# EasyEDA Pro project NI接口485_测试板子_3.eprj, board PCB1
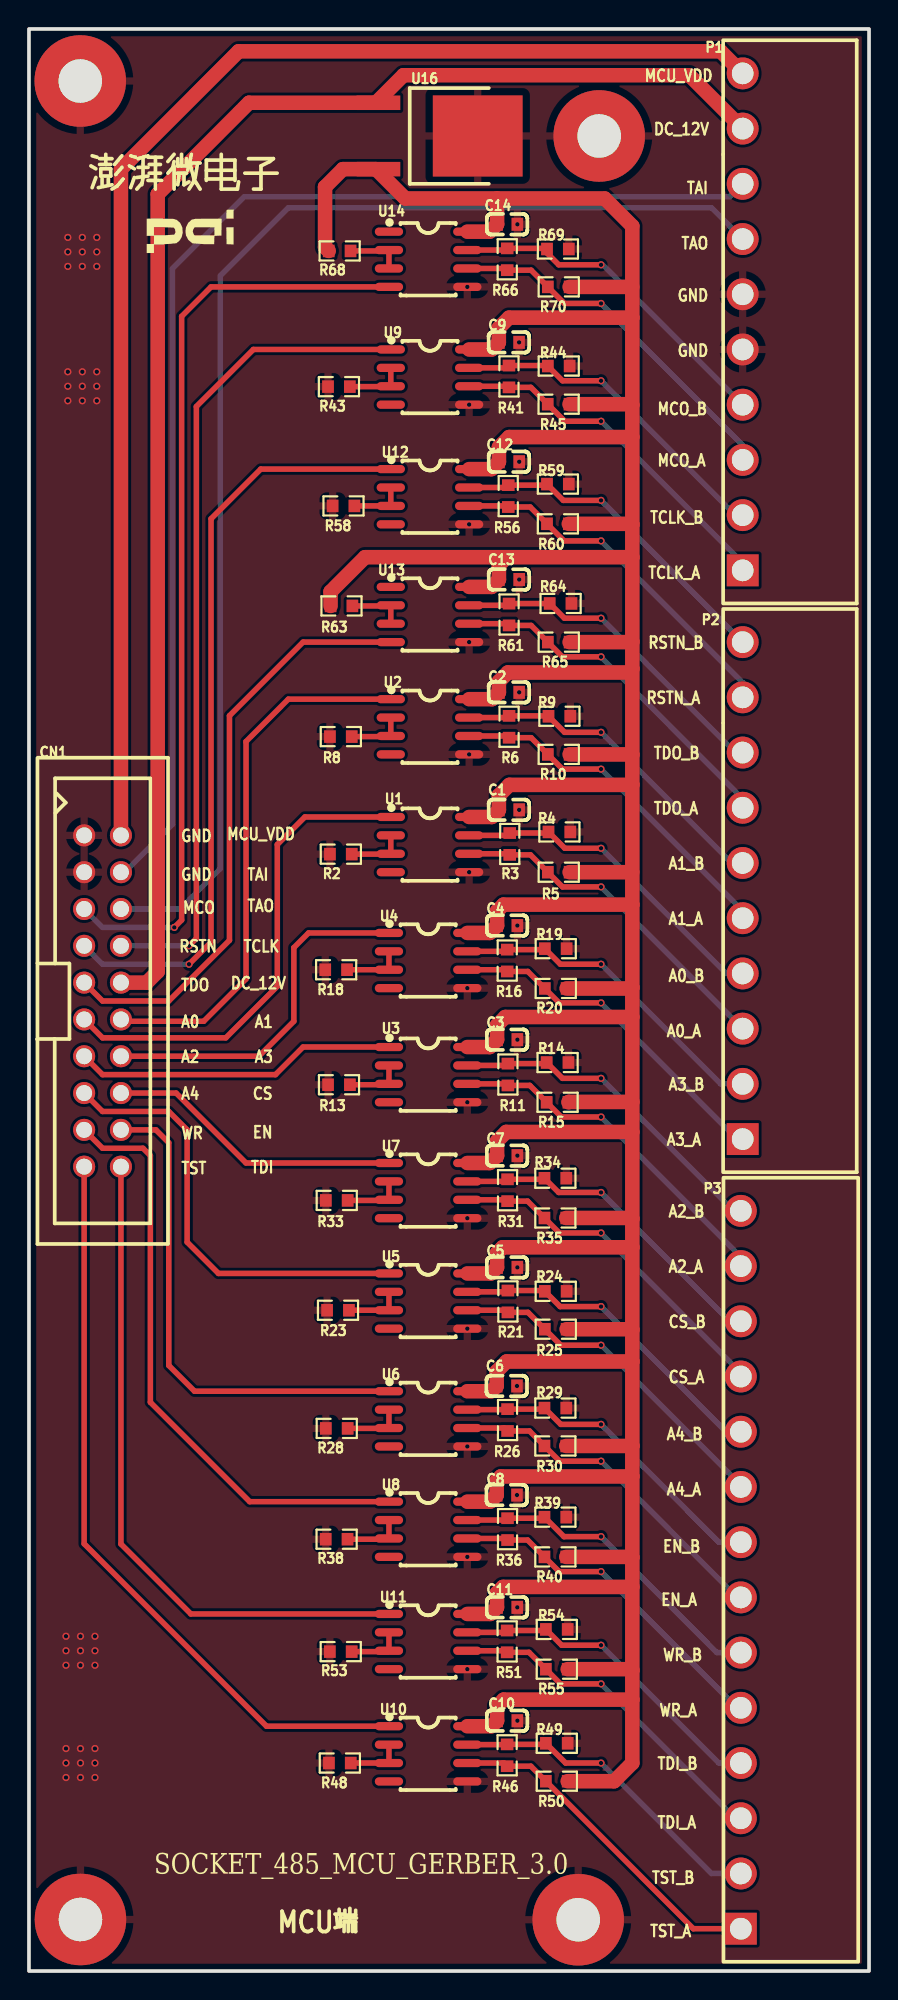
[diagram p2: board, top side]
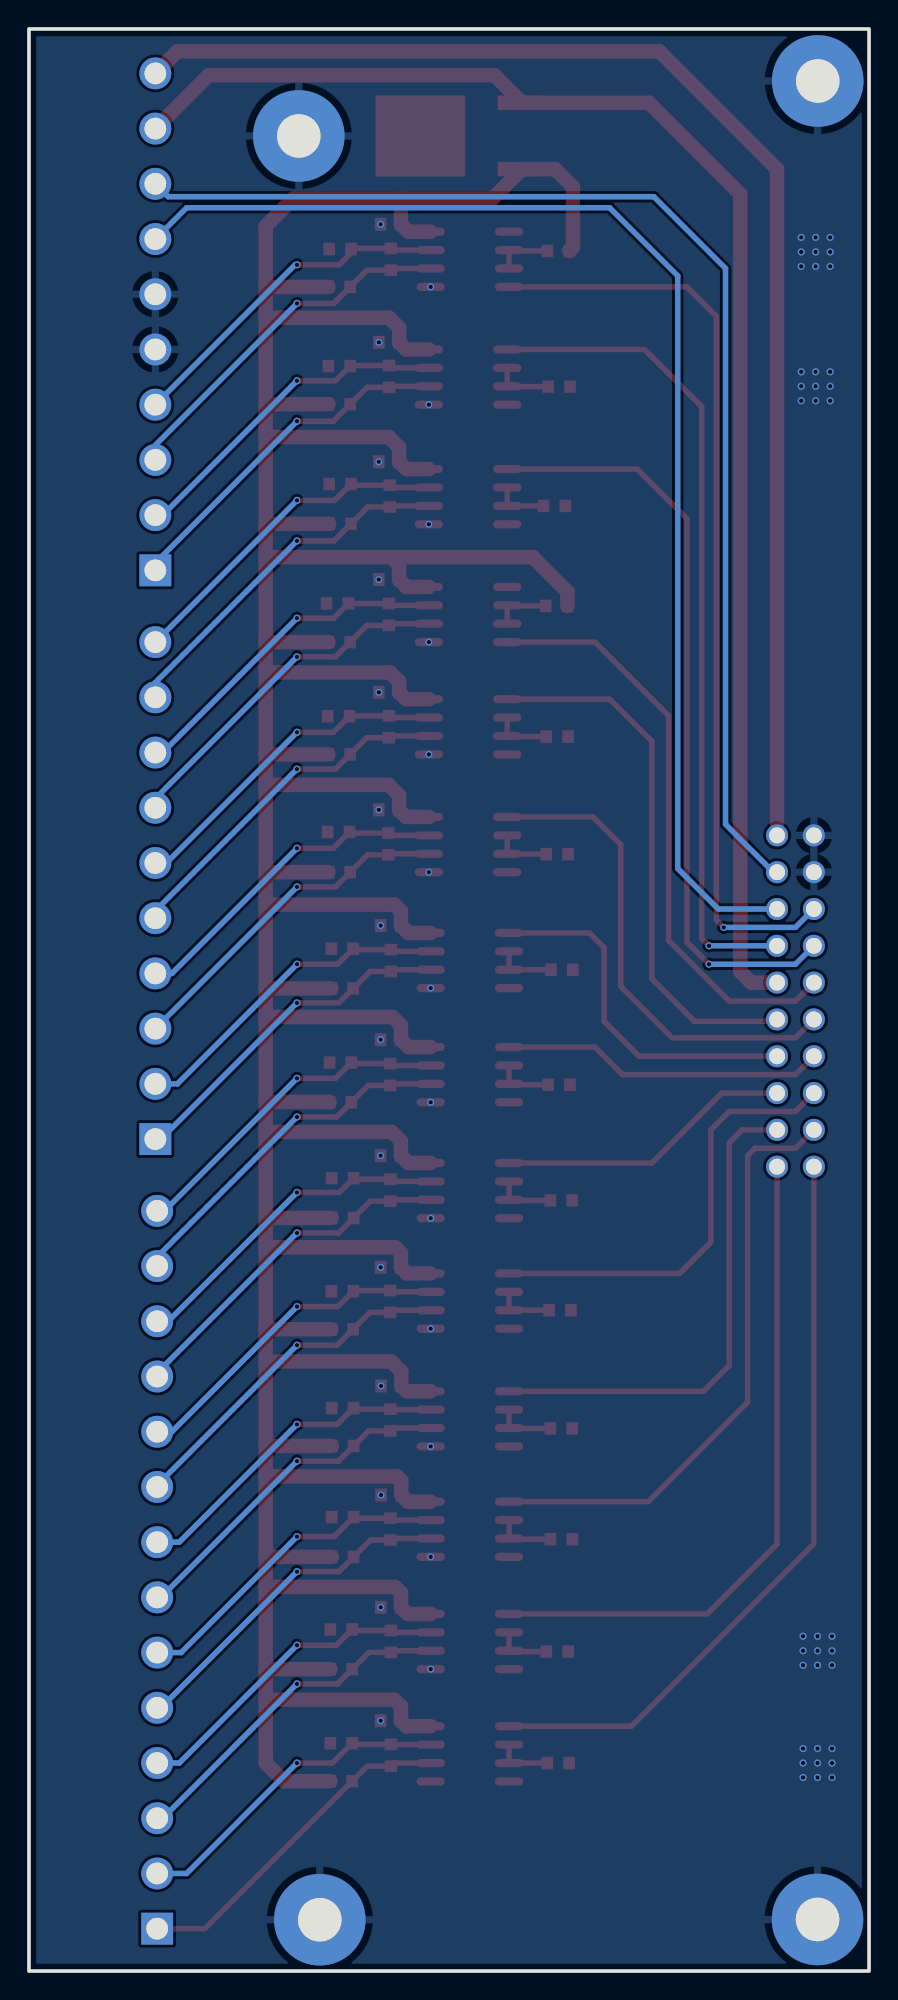
[diagram p3: board, bottom side, seen from below]

Outline 58 x 134 mm; copper layers: Top Layer, Bottom Layer. Coordinates in mm from the lower left corner of the outline.
Outline path: rectangle 0,134 58,0
Stack: Top Layer 0.035mm / Dielectric1 1.51mm FR4 er 4.5 / Bottom Layer 0.035mm

## Design rules (mm)
template: 自定义配置
spacing copperThickness1oz (default): track to track 0.102, other pairs 0.152 to 0.3
spacing copperThickness2oz: track to track 0.203, other pairs 0.152 to 0.3
track width copperThickness1oz (default): min 0.127, default 0.254, max 2.54
track width copperThickness2oz: min 0.203, default 0.254, max 2.54
differential pair differentialPair (default): width min 0.127, default 0.254, max 2.54; gap min 0.152, default 0.152
via viaSize (default): diameter min 0.5, default 0.61, max 10; hole min 0.3, default 0.305, max 6.3

## Placement (name value [footprint] x y rotation side)
C1  10uF  [C0603]  33.15 80.12 0 top
C2  10uF  [C0603]  33.15 88.23 0 top
C3  10uF  [C0603]  33.02 64.26 0 top
C4  10uF  [C0603]  33.02 72.14 0 top
C5  10uF  [C0603]  33.02 48.55 0 top
C6  10uF  [C0603]  32.99 40.37 0 top
C7  10uF  [C0603]  33.02 56.26 0 top
C8  10uF  [C0603]  32.99 32.84 0 top
C9  10uF  [C0603]  33.14 112.38 0 top
C10  10uF  [C0603]  33.02 17.27 0 top
C11  10uF  [C0603]  33.01 25.09 0 top
C12  10uF  [C0603]  33.15 104.14 0 top
C13  10uF  [C0603]  33.15 96.01 0 top
C14  10uF  [C0603]  33.02 120.52 0 top
CN1  BH254V-20P  [CONN-TH_20P-P2.54_0702462001]  5.08 66.93 270 top
J1  -  [demo板安装孔]  3.56 3.56 0 top
J2  -  [demo板安装孔]  39.37 126.62 0 top
J3  -  [demo板安装孔]  3.54 130.41 0 top
J4  -  [demo板安装孔]  37.92 3.54 0 top
P1  WJ15EDGRC-3.81-10P  [CONN-TH_10P-P3.81_WJ15EDGRC-3.81-10P]  49.28 113.79 90 top
P2  WJ15EDGRC-3.81-10P  [CONN-TH_10P-P3.81_WJ15EDGRC-3.81-10P]  49.28 74.55 90 top
P3  WJ15EDGRC-3.81-14P  [CONN-TH_14P-P3.81_WJ15EDGRC-3.81-14P]  49.15 27.69 90 top
R2  4.7kΩ  [R0603]  21.53 77.06 180 top
R3  120Ω  [R0603]  33.19 77.77 90 top
R4  4.7kΩ  [R0603]  36.62 78.59 0 top
R5  4.7kΩ  [R0603]  36.58 75.82 180 top
R6  120Ω  [R0603]  33.15 85.85 90 top
R8  4.7kΩ  [R0603]  21.53 85.17 180 top
R9  4.7kΩ  [R0603]  36.62 86.58 0 top
R10  4.7kΩ  [R0603]  36.58 83.95 180 top
R11  120Ω  [R0603]  33.07 61.86 90 top
R13  4.7kΩ  [R0603]  21.4 61.15 180 top
R14  4.7kΩ  [R0603]  36.5 62.69 0 top
R15  4.7kΩ  [R0603]  36.5 59.94 180 top
R16  120Ω  [R0603]  33.02 69.72 90 top
R18  4.7kΩ  [R0603]  21.21 69.09 180 top
R19  4.7kΩ  [R0603]  36.37 70.54 0 top
R20  4.7kΩ  [R0603]  36.37 67.8 180 top
R21  120Ω  [R0603]  33.07 46.2 90 top
R23  4.7kΩ  [R0603]  21.34 45.59 180 top
R24  4.7kΩ  [R0603]  36.37 46.9 0 top
R25  4.7kΩ  [R0603]  36.37 44.28 180 top
R26  120Ω  [R0603]  33.04 38.02 90 top
R28  4.7kΩ  [R0603]  21.25 37.44 180 top
R29  4.7kΩ  [R0603]  36.34 38.84 0 top
R30  4.7kΩ  [R0603]  36.34 36.23 180 top
R31  120Ω  [R0603]  33.04 53.87 90 top
R33  4.7kΩ  [R0603]  21.25 53.17 180 top
R34  4.7kΩ  [R0603]  36.34 54.7 0 top
R35  4.7kΩ  [R0603]  36.34 51.96 180 top
R36  120Ω  [R0603]  33.04 30.49 90 top
R38  4.7kΩ  [R0603]  21.24 29.79 180 top
R39  4.7kΩ  [R0603]  36.34 31.32 0 top
R40  4.7kΩ  [R0603]  36.34 28.57 180 top
R41  120Ω  [R0603]  33.14 110.03 90 top
R43  4.7kΩ  [R0603]  21.4 109.32 180 top
R44  4.7kΩ  [R0603]  36.58 110.74 0 top
R45  4.7kΩ  [R0603]  36.57 108.11 180 top
R46  120Ω  [R0603]  33.01 14.88 90 top
R48  4.7kΩ  [R0603]  21.46 14.35 180 top
R49  4.7kΩ  [R0603]  36.44 15.71 0 top
R50  4.7kΩ  [R0603]  36.44 13.1 180 top
R51  120Ω  [R0603]  33.01 22.74 90 top
R53  4.7kΩ  [R0603]  21.53 22.04 180 top
R54  4.7kΩ  [R0603]  36.44 23.57 0 top
R55  4.7kΩ  [R0603]  36.44 20.83 180 top
R56  120Ω  [R0603]  33.09 101.77 90 top
R58  4.7kΩ  [R0603]  21.72 101.09 180 top
R59  4.7kΩ  [R0603]  36.52 102.6 0 top
R60  4.7kΩ  [R0603]  36.52 99.86 180 top
R61  120Ω  [R0603]  33.15 93.6 90 top
R63  4.7kΩ  [R0603]  21.58 94.19 180 top
R64  4.7kΩ  [R0603]  36.7 94.36 0 top
R65  4.7kΩ  [R0603]  36.58 91.69 180 top
R66  120Ω  [R0603]  33.02 118.11 90 top
R68  4.7kΩ  [R0603]  21.45 118.69 180 top
R69  4.7kΩ  [R0603]  36.52 118.82 0 top
R70  4.7kΩ  [R0603]  36.58 116.21 180 top
U1  SP485EEN-L/TR  [SOIC-8_L5.0-W4.0-P1.27-LS6.0-BL]  27.69 77.72 270 top
U2  SP485EEN-L/TR  [SOIC-8_L5.0-W4.0-P1.27-LS6.0-BL]  27.69 85.85 270 top
U3  SP485EEN-L/TR  [SOIC-8_L5.0-W4.0-P1.27-LS6.0-BL]  27.56 61.85 270 top
U4  SP485EEN-L/TR  [SOIC-8_L5.0-W4.0-P1.27-LS6.0-BL]  27.56 69.72 270 top
U5  SP485EEN-L/TR  [SOIC-8_L5.0-W4.0-P1.27-LS6.0-BL]  27.56 46.23 270 top
U6  SP485EEN-L/TR  [SOIC-8_L5.0-W4.0-P1.27-LS6.0-BL]  27.56 38.1 270 top
U7  SP485EEN-L/TR  [SOIC-8_L5.0-W4.0-P1.27-LS6.0-BL]  27.56 53.85 270 top
U8  SP485EEN-L/TR  [SOIC-8_L5.0-W4.0-P1.27-LS6.0-BL]  27.56 30.48 270 top
U9  SP485EEN-L/TR  [SOIC-8_L5.0-W4.0-P1.27-LS6.0-BL]  27.69 109.98 270 top
U10  SP485EEN-L/TR  [SOIC-8_L5.0-W4.0-P1.27-LS6.0-BL]  27.56 14.99 270 top
U11  SP485EEN-L/TR  [SOIC-8_L5.0-W4.0-P1.27-LS6.0-BL]  27.56 22.73 270 top
U12  SP485EEN-L/TR  [SOIC-8_L5.0-W4.0-P1.27-LS6.0-BL]  27.69 101.73 270 top
U13  SP485EEN-L/TR  [SOIC-8_L5.0-W4.0-P1.27-LS6.0-BL]  27.69 93.6 270 top
U14  SP485EEN-L/TR  [SOIC-8_L5.0-W4.0-P1.27-LS6.0-BL]  27.56 118.11 270 top
U16  78M05  [TO-252-2_L6.5-W5.5-P4.58-LS9.8-BR-CW]  27.56 126.62 180 top

## Footprints (pads in the part's own frame, mm; a bottom-side part is the same pattern mirrored in y, then rotated)
C0603
  rect 0.8x0.9 smd: 1(-0.7,0) 2(0.7,0)
CONN-TH_10P-P3.81_WJ15EDGRC-3.81-10P
  rect 2.2x2.2 hole 1.5: 1(-17.145,0)
  round 2.2 hole 1.5: 2(-13.335,0) 3(-9.525,0) 4(-5.715,0) 5(-1.905,0) 6(1.905,0) 7(5.715,0) 8(9.525,0) 9(13.335,0) 10(17.145,0)
CONN-TH_14P-P3.81_WJ15EDGRC-3.81-14P
  rect 2.2x2.2 hole 1.5: 1(-24.765,0)
  round 2.2 hole 1.5: 2(-20.955,0) 3(-17.145,0) 4(-13.335,0) 5(-9.525,0) 6(-5.715,0) 7(-1.905,0) 8(1.905,0) 9(5.715,0) 10(9.525,0) 11(13.335,0) 12(17.145,0) 13(20.955,0) 14(24.765,0)
CONN-TH_20P-P2.54_0702462001
  round 1.524 hole 1.1: 1(-11.43,-1.27) 2(-11.43,1.27) 3(-8.89,-1.27) 4(-8.89,1.27) 5(-6.35,-1.27) 6(-6.35,1.27) 7(-3.81,-1.27) 8(-3.81,1.27) 9(-1.27,-1.27) 10(-1.27,1.27) 11(1.27,-1.27) 12(1.27,1.27) 13(3.81,-1.27) 14(3.81,1.27) 15(6.35,-1.27) 16(6.35,1.27) 17(8.89,-1.27) 18(8.89,1.27) 19(11.43,-1.27) 20(11.43,1.27)
demo板安装孔
  round 6.32 hole 3: 1(0,0)
R0603
  rect 0.806x0.864 smd: 1(-0.753,0) 2(0.753,0)
SOIC-8_L5.0-W4.0-P1.27-LS6.0-BL
  oval 0.569x1.95 smd: 1(-1.905,-2.705) 2(-0.635,-2.705) 3(0.635,-2.705) 4(1.905,-2.705) 5(1.905,2.705) 6(0.635,2.705) 7(-0.635,2.705) 8(-1.905,2.705)
TO-252-2_L6.5-W5.5-P4.58-LS9.8-BR-CW
  rect 3x1 smd: 1(3.423,-2.29) 3(3.424,2.29)
  rect 6.2x5.6 smd: 2(-3.424,0)

## Nets
As in the schematic, except:
GND: C1.2 C2.2 C3.2 C4.2 C5.2 C6.2 C7.2 C8.2 C9.2 C10.2 C11.2 C12.2 C13.2 C14.2 CN1.1 CN1.3 J1.1 J2.1 J3.1 J4.1 P1.5 P1.6 R2.2 R4.2 R8.2 R9.2 R13.2 R14.2 R18.2 R19.2 R23.2 R24.2 R28.2 R29.2 R33.2 R34.2 R38.2 R39.2 R43.2 R44.2 R48.2 R49.2 R53.2 R54.2 R58.2 R59.2 R64.2 R69.2 U1.5 U2.5 U3.5 U4.5 U5.5 U6.5 U7.5 U8.5 U9.5 U10.5 U11.5 U12.5 U13.5 U14.5 U16.2
LDO_5V: C1.1 C2.1 C3.1 C4.1 C5.1 C6.1 C7.1 C8.1 C9.1 C10.1 C11.1 C12.1 C13.1 C14.1 R5.1 R10.1 R15.1 R20.1 R25.1 R30.1 R35.1 R40.1 R45.1 R50.1 R55.1 R60.1 R63.2 R65.1 R68.2 R70.1 U1.8 U2.8 U3.8 U4.8 U5.8 U6.8 U7.8 U8.8 U9.8 U10.8 U11.8 U12.8 U13.8 U14.8 U16.3
RSTN_NI_A: P2.9 R56.1 R60.2 U12.6
RSTN_NI_B: P2.10 R56.2 R59.1 U12.7

Pads without a net: U1 4; U2 4; U3 4; U4 4; U5 4; U6 4; U7 4; U8 4; U9 4; U10 4; U11 4; U12 4; U13 1; U14 1

## Via types
v1: diameter 0.5, hole 0.305, Top Layer to Bottom Layer, 93 vias

## Routing (per net, layer and track width the routed paths; a pad name or vN(x,y) marks a point on that pad's centre or on a via; arc(x,y) is an arc through that point)
GND:
  vias: v1(2.56,23.1) v1(2.56,22.1) v1(2.56,21.1) v1(2.56,15.35) v1(2.56,14.35) v1(2.56,13.35) v1(2.68,119.62) v1(2.68,118.62) v1(2.68,117.62) v1(2.68,110.35) v1(2.68,109.35) v1(2.68,108.35) v1(3.56,23.1) v1(3.56,22.1) v1(3.56,21.1) v1(3.56,15.35) v1(3.56,14.35) v1(3.56,13.35) v1(3.68,119.62) v1(3.68,118.62) v1(3.68,117.62) v1(3.68,110.35) v1(3.68,109.35) v1(3.68,108.35) v1(4.56,23.1) v1(4.56,22.1) v1(4.56,21.1) v1(4.56,15.35) v1(4.56,14.35) v1(4.56,13.35) v1(4.68,119.62) v1(4.68,118.62) v1(4.68,117.62) v1(4.68,110.35) v1(4.68,109.35) v1(4.68,108.35) v1(30.26,116.21) v1(30.26,67.82) v1(30.26,59.94) v1(30.26,51.94) v1(30.26,44.32) v1(30.26,36.19) v1(30.26,28.58) v1(30.26,20.83) v1(30.39,108.08) v1(30.39,99.82) v1(30.39,91.69) v1(30.39,83.95) v1(30.39,75.82) v1(33.72,120.52) v1(33.72,72.14) v1(33.72,64.26) v1(33.72,56.26) v1(33.72,48.55) v1(33.69,40.37) v1(33.69,32.84) v1(33.71,25.09) v1(33.72,17.27) v1(33.84,112.38) v1(33.85,104.14) v1(33.85,96.01) v1(33.84,88.23) v1(33.84,80.12)
DC_12V: length 101.8
  Top Layer w1: P1.9 45.59,130.81 25.86,130.81 23.96,128.91 15.19,128.91 8.89,122.61 8.89,68.96 8.13,68.2 CN1.10
LDO_5V: length 380.7
  Top Layer w1: 41.66,18.72 32.77,18.72 32.32,18.27 C10.1 31.94,16.89 U10.8 ; 41.66,18.72 41.66,14.35 40.4,13.1 R50.1 ; 41.66,18.72 41.66,20.75 ; 41.66,73.58 41.66,67.86 ; 41.66,73.58 32.76,73.58 32.32,73.14 C4.1 31.81,71.63 U4.8 ; 41.66,73.58 41.66,81.84 ; 41.66,67.86 41.66,65.83 ; 41.66,67.86 41.59,67.8 R20.1 ; R45.1 41.6,108.11 41.66,108.05 ; R70.1 41.66,116.21 ; 41.66,83.91 41.66,81.84 ; 41.66,83.91 41.66,89.85 ; 41.66,83.91 41.62,83.95 R10.1 ; 41.66,81.84 33.17,81.84 32.44,81.12 C1.1 31.95,79.63 U1.8 ; U9.8 31.95,111.89 C9.1 32.44,113.38 33.14,114.08 41.66,114.08 ; R30.1 41.65,36.23 41.66,36.24 ; 41.66,44.24 41.66,42.06 ; 41.66,44.24 41.61,44.28 R25.1 ; 41.66,44.24 41.66,49.94 ; 41.66,42.06 32.98,42.06 32.29,41.37 C6.1 31.93,40.01 U6.8 ; 41.66,42.06 41.66,36.24 ; 41.66,34.13 41.66,28.54 ; 41.66,34.13 32.58,34.13 32.29,33.84 C8.1 31.84,32.38 U8.8 ; 41.66,34.13 41.66,36.24 ; 41.66,28.54 41.66,26.5 ; 41.66,28.54 41.63,28.57 R40.1 ; 41.66,26.5 41.66,20.75 ; 41.66,26.5 32.72,26.5 32.31,26.09 C11.1 31.86,24.64 U11.8 ; 41.66,20.75 41.58,20.83 R55.1 ; 41.66,99.81 41.61,99.86 R60.1 ; 41.66,99.81 41.66,97.55 ; 41.66,99.81 41.66,105.84 ; 41.66,108.05 41.66,105.84 ; 41.66,108.05 41.66,114.08 ; 41.66,97.55 41.66,91.72 ; 41.66,97.55 32.99,97.55 ; 41.66,91.72 41.66,89.85 ; 41.66,91.72 41.63,91.69 R65.1 ; R5.1 41.66,75.82 ; 41.66,105.84 33.15,105.84 32.45,105.14 C12.1 31.94,103.63 U12.8 ; 41.66,65.83 32.88,65.83 32.32,65.26 C3.1 31.81,63.75 U3.8 ; 41.66,65.83 41.66,59.97 ; 32.99,97.55 23.2,97.55 20.82,95.17 R63.2 ; 32.99,97.55 32.45,97.01 C13.1 31.94,95.5 U13.8 ; R35.1 41.6,51.96 41.66,51.9 ; 41.66,51.9 41.66,49.94 ; 41.66,51.9 41.66,57.9 ; 41.66,49.94 32.7,49.94 32.32,49.55 C5.1 31.9,48.13 U5.8 ; 32.3,122.3 25.99,122.3 23.96,124.33 21.67,124.33 20.44,123.1 20.44,118.94 R68.2 ; 32.3,122.3 32.32,122.29 C14.1 31.81,120.02 U14.8 ; 32.3,122.3 39.75,122.3 41.66,120.4 41.66,114.08 ; 41.66,89.85 41.4,89.6 33.07,89.6 32.44,88.98 C2.1 31.97,87.76 U2.8 ; 41.66,59.97 37.27,59.97 R15.1 ; 41.66,59.97 41.66,57.9 ; 41.66,57.9 32.95,57.9 32.32,57.26 C7.1 31.81,55.75 U7.8
MCO_NI: length 64.3
  Top Layer w0.38: U14.4 12.57,116.21 10.54,114.17 10.54,72.52 v1(10.03,72.01)
  Bottom Layer w0.38: v1(10.03,72.01) 5.08,72.01 3.81,73.28
MCO_NI_A: length 25.1
  Top Layer w0.38: U14.6 32.9,117.48 R66.1 34.67,117.36 R70.2 36.97,115.06 v1(39.5,115.06)
  Bottom Layer w0.38: v1(39.5,115.06) 49.28,105.28 P1.3
MCO_NI_B: length 23.7
  Top Layer w0.38: v1(39.5,117.73) 36.58,117.73 35.77,118.54 R69.1 35.72,118.86 R66.2 32.9,118.75 U14.7
  Bottom Layer w0.38: P1.4 39.62,117.73 v1(39.5,117.73)
MCU_VDD: length 92.9
  Top Layer w1: P1.10 47.75,132.46 14.48,132.46 6.35,124.33 CN1.2
RSTN_NI: length 53
  Top Layer w0.38: U12.1 16,103.63 12.57,100.2 12.57,70.99 v1(11.05,69.47)
  Bottom Layer w0.38: v1(11.05,69.47) 5.08,69.47 CN1.7
RSTN_NI_A: length 25
  Top Layer w0.38: v1(39.5,98.68) 36.94,98.68 R60.2 34.6,101.02 R56.1 33.01,101.09 U12.6
  Bottom Layer w0.38: P2.9 49.28,88.9 v1(39.5,98.68)
RSTN_NI_B: length 23.5
  Top Layer w0.38: v1(39.5,101.47) 36.89,101.47 R59.1 35.69,102.52 R56.2 32.93,102.36 U12.7
  Bottom Layer w0.38: v1(39.5,101.47) P2.10
SW_A0: length 33.7
  Top Layer w0.38: U1.1 19.05,79.63 17.15,77.73 17.15,67.95 13.59,64.39 5.08,64.39 CN1.11
SW_A0_A: length 23.9
  Top Layer w0.38: U1.6 33.12,77.09 R3.1 34.63,77.01 R5.2 36.84,74.8 v1(39.5,74.8)
  Bottom Layer w0.38: v1(39.5,74.8) P2.3
SW_A0_B: length 23
  Top Layer w0.38: v1(39.5,77.47) 37,77.47 R4.1 35.8,78.52 R3.2 33.03,78.36 U1.7
  Bottom Layer w0.38: v1(39.5,77.47) 48.13,68.83 P2.4
SW_A1: length 37.5
  Top Layer w0.38: U2.1 17.91,87.76 14.99,84.84 14.99,68.45 12.06,65.53 6.48,65.53 CN1.12
SW_A1_A: length 24.4
  Top Layer w0.38: v1(39.5,82.93) 36.84,82.93 R10.2 34.67,85.1 R6.1 33.03,85.22 U2.6
  Bottom Layer w0.38: v1(39.5,82.93) 49.28,73.15 P2.5
SW_A1_B: length 23.1
  Top Layer w0.38: U2.7 33.03,86.49 R6.2 35.84,86.61 R9.1 36.98,85.47 v1(39.5,85.47)
  Bottom Layer w0.38: v1(39.5,85.47) 48.51,76.45 P2.6
SW_A2: length 22.4
  Top Layer w0.38: CN1.13 5.08,61.85 17.02,61.85 18.92,63.75 U3.1
SW_A2_A: length 24.5
  Top Layer w0.38: U3.6 32.96,61.21 R11.1 34.58,61.1 R15.2 36.76,58.93 v1(39.5,58.93)
  Bottom Layer w0.38: v1(39.5,58.93) 49.15,49.28 P3.13
SW_A2_B: length 23.2
  Top Layer w0.38: U3.7 32.94,62.48 R11.2 35.67,62.61 R14.1 36.83,61.59 v1(39.5,61.59)
  Bottom Layer w0.38: v1(39.5,61.59) 48.64,52.45 P3.14
SW_A3: length 25
  Top Layer w0.38: CN1.14 15.88,63.12 18.29,65.53 18.29,70.61 19.3,71.63 U4.1
SW_A3_A: length 23.9
  Top Layer w0.38: v1(39.5,66.8) 36.61,66.8 R20.2 34.44,68.97 R16.1 32.9,69.09 U4.6
  Bottom Layer w0.38: v1(39.5,66.8) 48.9,57.4 P2.1
SW_A3_B: length 23
  Top Layer w0.38: U4.7 32.9,70.36 R16.2 35.55,70.48 R19.1 36.69,69.47 v1(39.5,69.47)
  Bottom Layer w0.38: v1(39.5,69.47) 47.75,61.21 P2.2
SW_A4: length 30.7
  Top Layer w0.38: CN1.15 5.08,59.31 9.65,59.31 10.92,58.04 10.92,50.29 13.08,48.13 U5.1
SW_A4_A: length 24
  Top Layer w0.38: v1(39.5,43.18) 36.72,43.18 R25.2 34.45,45.45 R21.1 32.92,45.59 U5.6
  Bottom Layer w0.38: v1(39.5,43.18) 49.15,33.53 P3.9
SW_A4_B: length 23
  Top Layer w0.38: U5.7 32.98,46.86 R21.2 35.56,46.95 R24.1 36.67,45.85 v1(39.5,45.85)
  Bottom Layer w0.38: P3.10 48.13,37.21 v1(39.5,45.85)
SW_CS_N: length 20.5
  Top Layer w0.38: U7.1 14.99,55.75 10.16,60.58 CN1.16
SW_CS_N_A: length 24.1
  Top Layer w0.38: v1(39.5,50.93) 36.62,50.93 R35.2 34.43,53.12 R31.1 32.95,53.21 U7.6
  Bottom Layer w0.38: v1(39.5,50.93) 49.15,41.28 49.15,41.02
SW_CS_N_B: length 23.1
  Top Layer w0.38: U7.7 32.9,54.48 R31.2 35.52,54.63 R34.1 36.57,53.72 v1(39.5,53.72)
  Bottom Layer w0.38: v1(39.5,53.72) 48.39,44.83 P3.12
SW_EN_N: length 35
  Top Layer w0.38: U6.1 11.43,40.01 9.65,41.78 9.65,57.15 8.76,58.04 CN1.18
SW_EN_N_A: length 23.7
  Top Layer w0.38: v1(39.5,35.18) 36.64,35.18 R30.2 34.56,37.26 R26.1 32.84,37.47 U6.6
  Bottom Layer w0.38: v1(39.5,35.18) 48.9,25.78 P3.7
SW_EN_N_B: length 22.8
  Top Layer w0.38: v1(39.5,37.72) 36.72,37.72 R29.1 35.52,38.77 R26.2 33.01,38.74 30.26,38.74
  Bottom Layer w0.38: P3.8 47.62,29.59 v1(39.5,37.72)
SW_WR_N: length 41.6
  Top Layer w0.38: CN1.17 5.08,56.77 7.87,56.77 8.38,56.26 8.38,39.24 15.24,32.38 U8.1
SW_WR_N_A: length 23.7
  Top Layer w0.38: v1(39.5,27.56) 36.6,27.56 R40.2 34.43,29.74 R36.1 32.93,29.84 30.26,29.84
  Bottom Layer w0.38: v1(39.5,27.56) 48.9,18.16 P3.5
SW_WR_N_B: length 22.8
  Top Layer w0.38: v1(39.5,29.97) 36.94,29.97 R39.1 35.52,31.24 R36.2 32.91,31.12 U8.7
  Bottom Layer w0.38: P3.6 47.5,21.97 v1(39.5,29.97)
TAI_NI: length 85.1
  Bottom Layer w0.38: CN1.4 6.6,75.82 9.91,79.12 9.91,117.48 14.86,122.43 48.39,122.43 P1.8
TAO_NI: length 87.8
  Bottom Layer w0.38: 6.35,73.28 10.41,73.28 13.21,76.07 13.21,116.97 17.91,121.67 47.12,121.67 P1.7
TCLK_NI: length 57.2
  Top Layer w0.38: U9.1 15.49,111.89 11.56,107.95 11.56,71.25 v1(11.05,70.74)
  Bottom Layer w0.38: v1(11.05,70.74) CN1.8
TCLK_NI_A: length 24.4
  Top Layer w0.38: U9.6 33.07,109.35 R41.1 34.65,109.27 R45.2 36.99,106.93 v1(39.5,106.93)
  Bottom Layer w0.38: P1.1 49.28,97.16 v1(39.5,106.93)
TCLK_NI_B: length 23.2
  Top Layer w0.38: v1(39.5,109.73) 36.84,109.73 R44.1 35.79,110.78 R41.2 32.98,110.62 U9.7
  Bottom Layer w0.38: P1.2 48.77,100.46 v1(39.5,109.73)
TDI_NI: length 46.5
  Top Layer w0.38: U11.1 11.18,24.64 6.35,29.46 6.35,55.5
TDI_NI_A: length 23.7
  Top Layer w0.38: v1(39.5,19.81) 36.7,19.81 R55.2 34.53,21.99 R51.1 32.9,22.1 U11.6
  Bottom Layer w0.38: v1(39.5,19.81) 48.77,10.54 P3.3
TDI_NI_B: length 22.8
  Top Layer w0.38: U11.7 32.89,23.37 R51.2 35.62,23.5 R54.1 36.78,22.48 v1(39.5,22.48)
  Bottom Layer w0.38: v1(39.5,22.48) 47.62,14.35 P3.4
TDO_NI: length 41
  Top Layer w0.38: U13.4 18.92,91.69 13.84,86.61 13.84,71.12 9.65,66.93 5.08,66.93 CN1.9
TDO_NI_A: length 24.5
  Top Layer w0.38: v1(39.5,90.68) 36.84,90.68 R65.2 34.67,92.85 R61.1 33.03,92.96 U13.6
  Bottom Layer w0.38: P2.7 49.28,80.9 v1(39.5,90.68)
TDO_NI_B: length 23.2
  Top Layer w0.38: v1(39.5,93.34) 36.97,93.34 R64.1 35.94,94.35 R61.2 33.03,94.23 U13.7
  Bottom Layer w0.38: P2.8 48.77,84.07 v1(39.5,93.34)
TSTROBE_NI: length 52.3
  Top Layer w0.38: 3.81,55.5 3.81,29.48 16.4,16.89 U10.1
TSTROBE_NI_A: length 23.6
  Top Layer w0.38: U10.6 32.79,14.35 R46.1 34.65,14.13 R50.2 45.87,2.92 P3.1
TSTROBE_NI_B: length 22.6
  Top Layer w0.38: U10.7 33,15.62 R46.2 35.62,15.64 R49.1 37.05,14.35 v1(39.5,14.35)
  Bottom Layer w0.38: P3.2 47.12,6.73 v1(39.5,14.35)
$1N832: length 4
  Top Layer w0.38: U1.2 U1.3 24.96,77.06 R2.1
$1N23092: length 4
  Top Layer w0.38: R8.1 24.94,85.17 U2.3 U2.2
$1N23454: length 4
  Top Layer w0.38: 22.16,61.15 24.79,61.15 U3.3 U3.2
$1N23823: length 4.2
  Top Layer w0.38: R18.1 U4.3 U4.2
$1N24177: length 4
  Top Layer w0.38: R23.1 U5.3 U5.2
$1N24547: length 4.1
  Top Layer w0.38: 24.85,38.74 U6.3 24.83,37.44 R28.1
$1N24901: length 4.1
  Top Layer w0.38: R33.1 24.81,53.17 U7.3 U7.2
$1N25255: length 4.2
  Top Layer w0.38: U8.2 24.85,29.84 24.8,29.79 R38.1
$1N26283: length 4.1
  Top Layer w0.38: U9.2 U9.3 24.96,109.32 R43.1
$1N26304: length 3.9
  Top Layer w0.38: R48.1 U10.3 U10.2
$1N26325: length 3.9
  Top Layer w0.38: U11.2 U11.3 24.79,22.04 R53.1
$1N27345: length 3.8
  Top Layer w0.38: R58.1 U12.3 U12.2
$1N27366: length 3.9
  Top Layer w0.38: R63.1 24.94,94.19 U13.2 U13.3
$1N27387: length 3.9
  Top Layer w0.38: R68.1 24.79,118.69 U14.2 U14.3

## Copper pours and planes (outline as drawn; the poured copper is in the pictures)
GND on Top Layer: 0,134 58,134 58,0 0,0
GND on Bottom Layer: 0,134 58,134 58,0 0,0

## Text on the board
Top Silkscreen Layer: RSTN | GND | TDO | A0 | A2 | A4 | WR | TST | MCU_VDD | DC_12V | TCLK | TAI | TAO | TDI | CS | EN | A1 | A3 | RSTN_A | TCLK_A | RSTN_B | TCLK_B | TST_A | TST_B | TDO_B | TDO_A | MCO_B | MCO_A | TDI_B | TDI_A | WR_A | EN_A | EN_B | WR_B | A0_A | A3_A | A4_B | A4_A | A1_B | A1_A | A0_B | A3_B | A2_B | A2_A | CS_B | CS_A | MCO | 澎湃微电子 | SOCKET_485_MCU_GERBER_3.0 | MCU端
